# EAGLE board Layer 1 (EAGLE 9.6.2), part 1 of 2
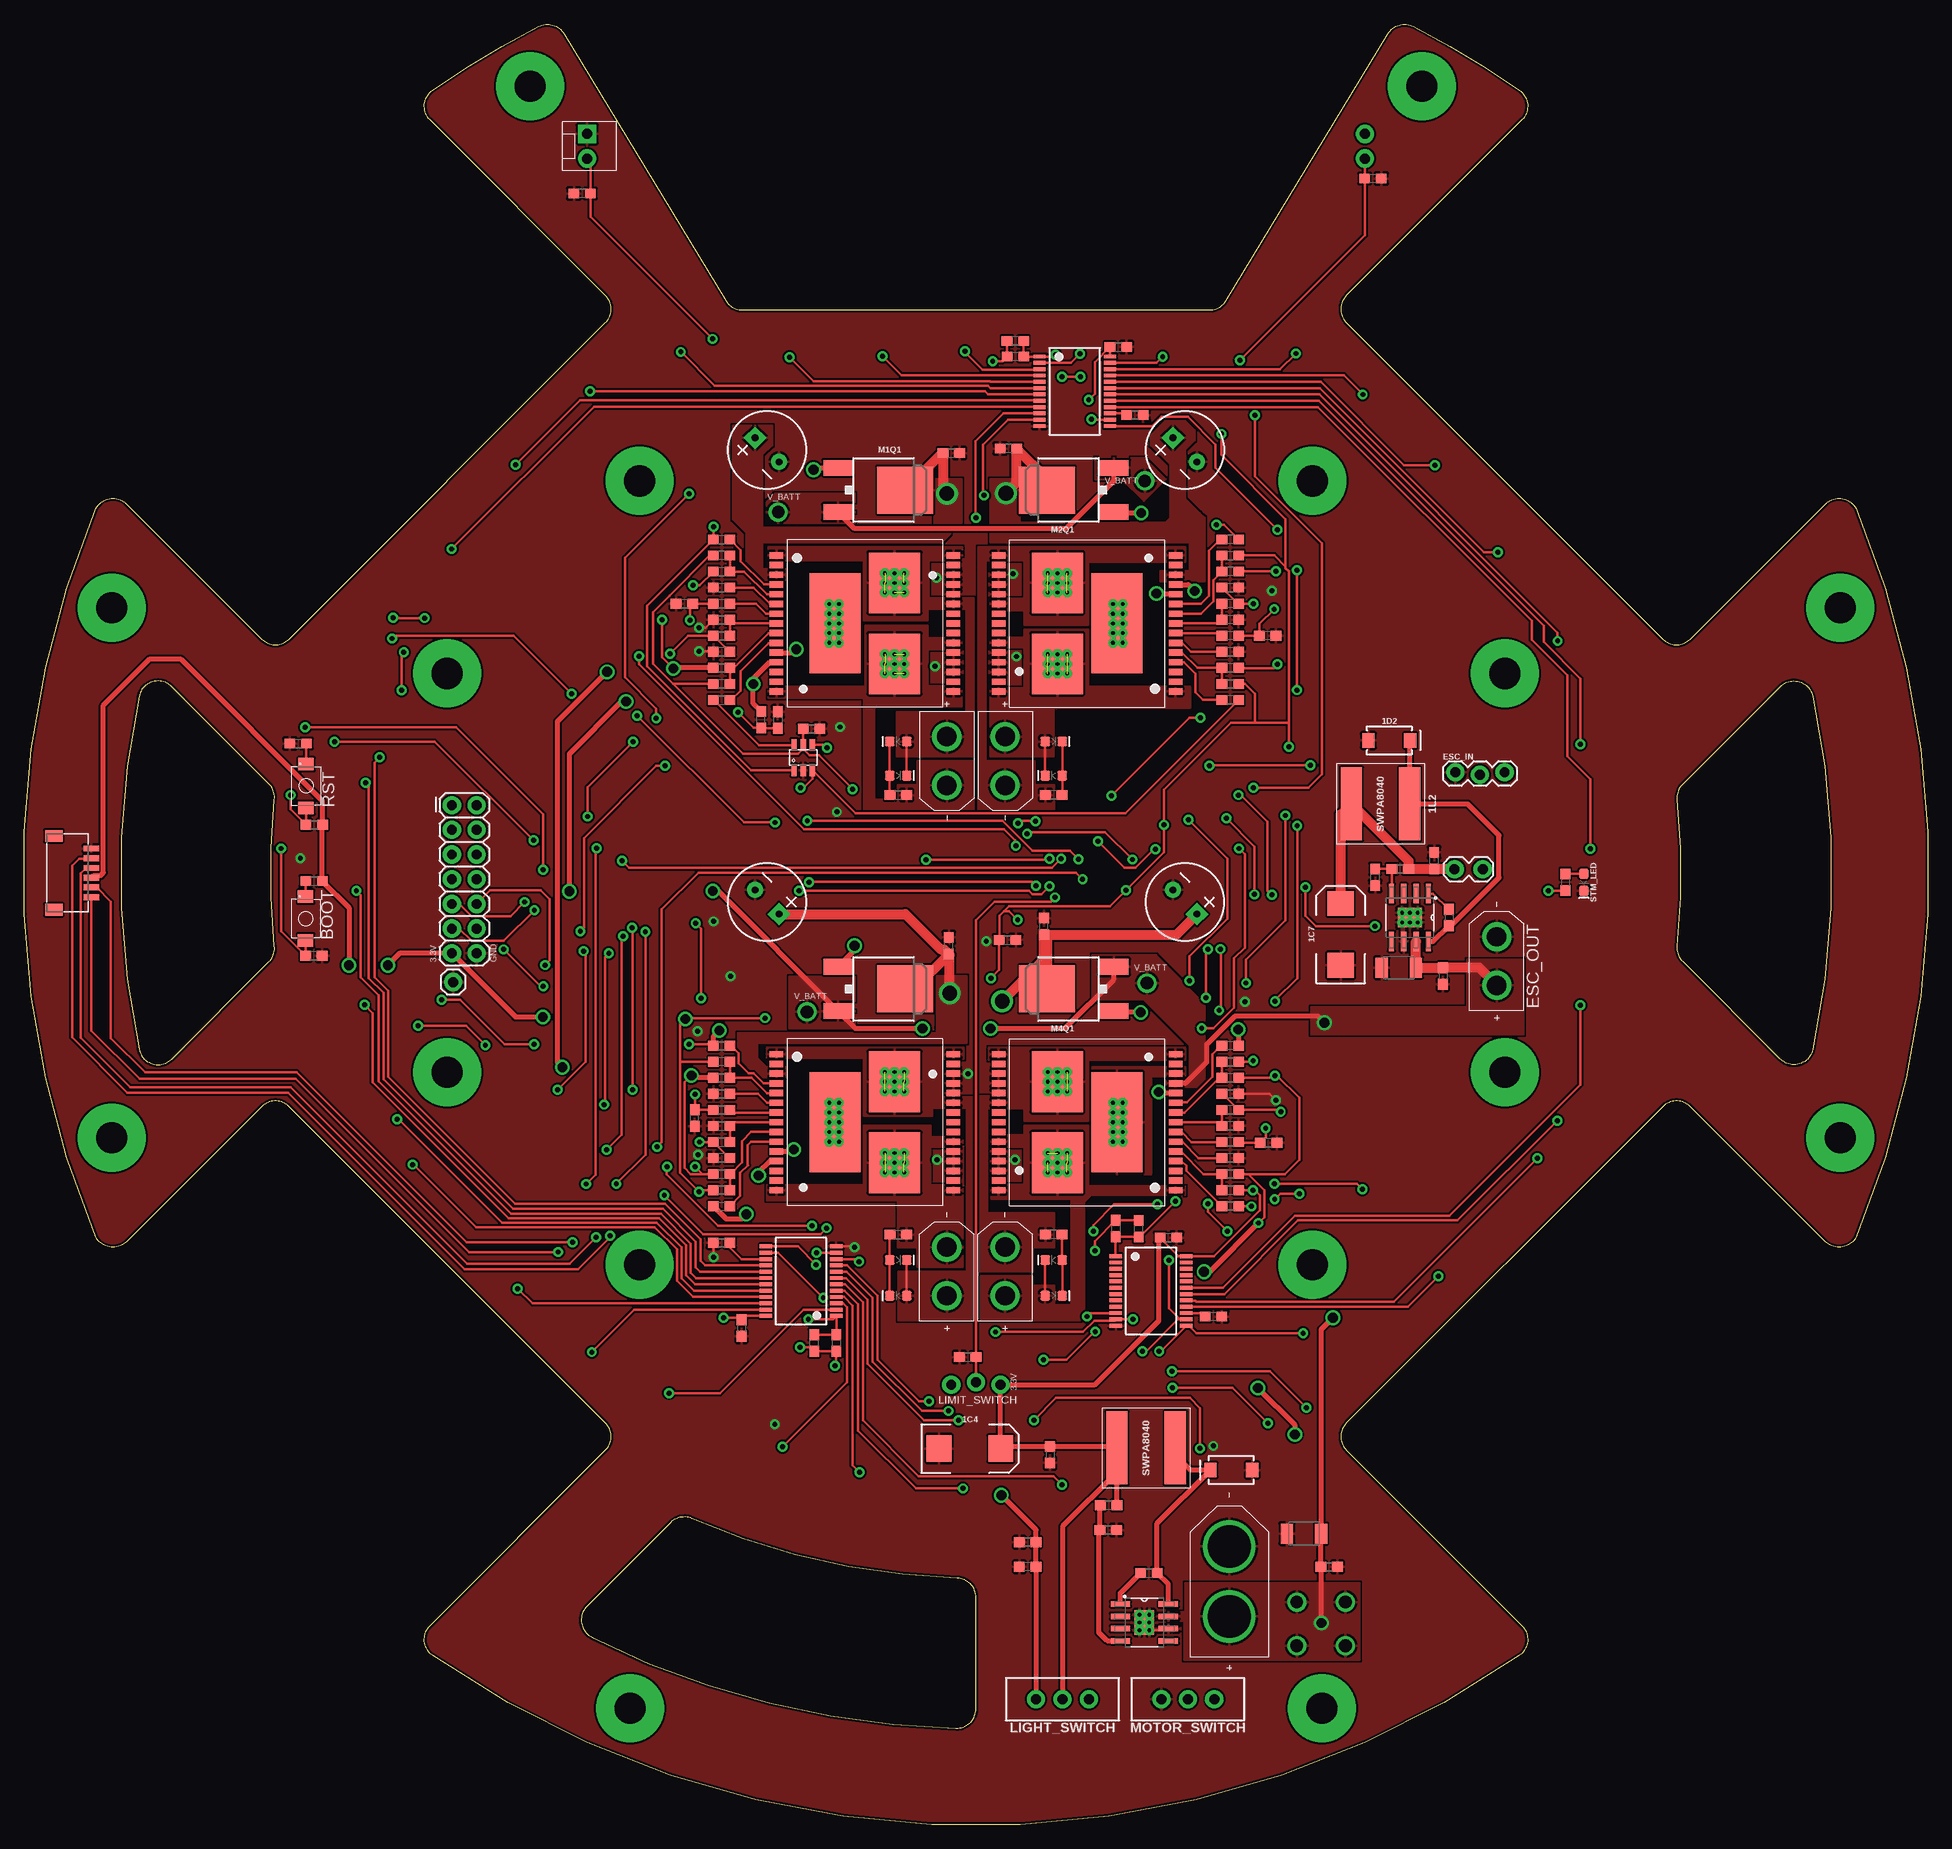
[diagram p5: board, top side]
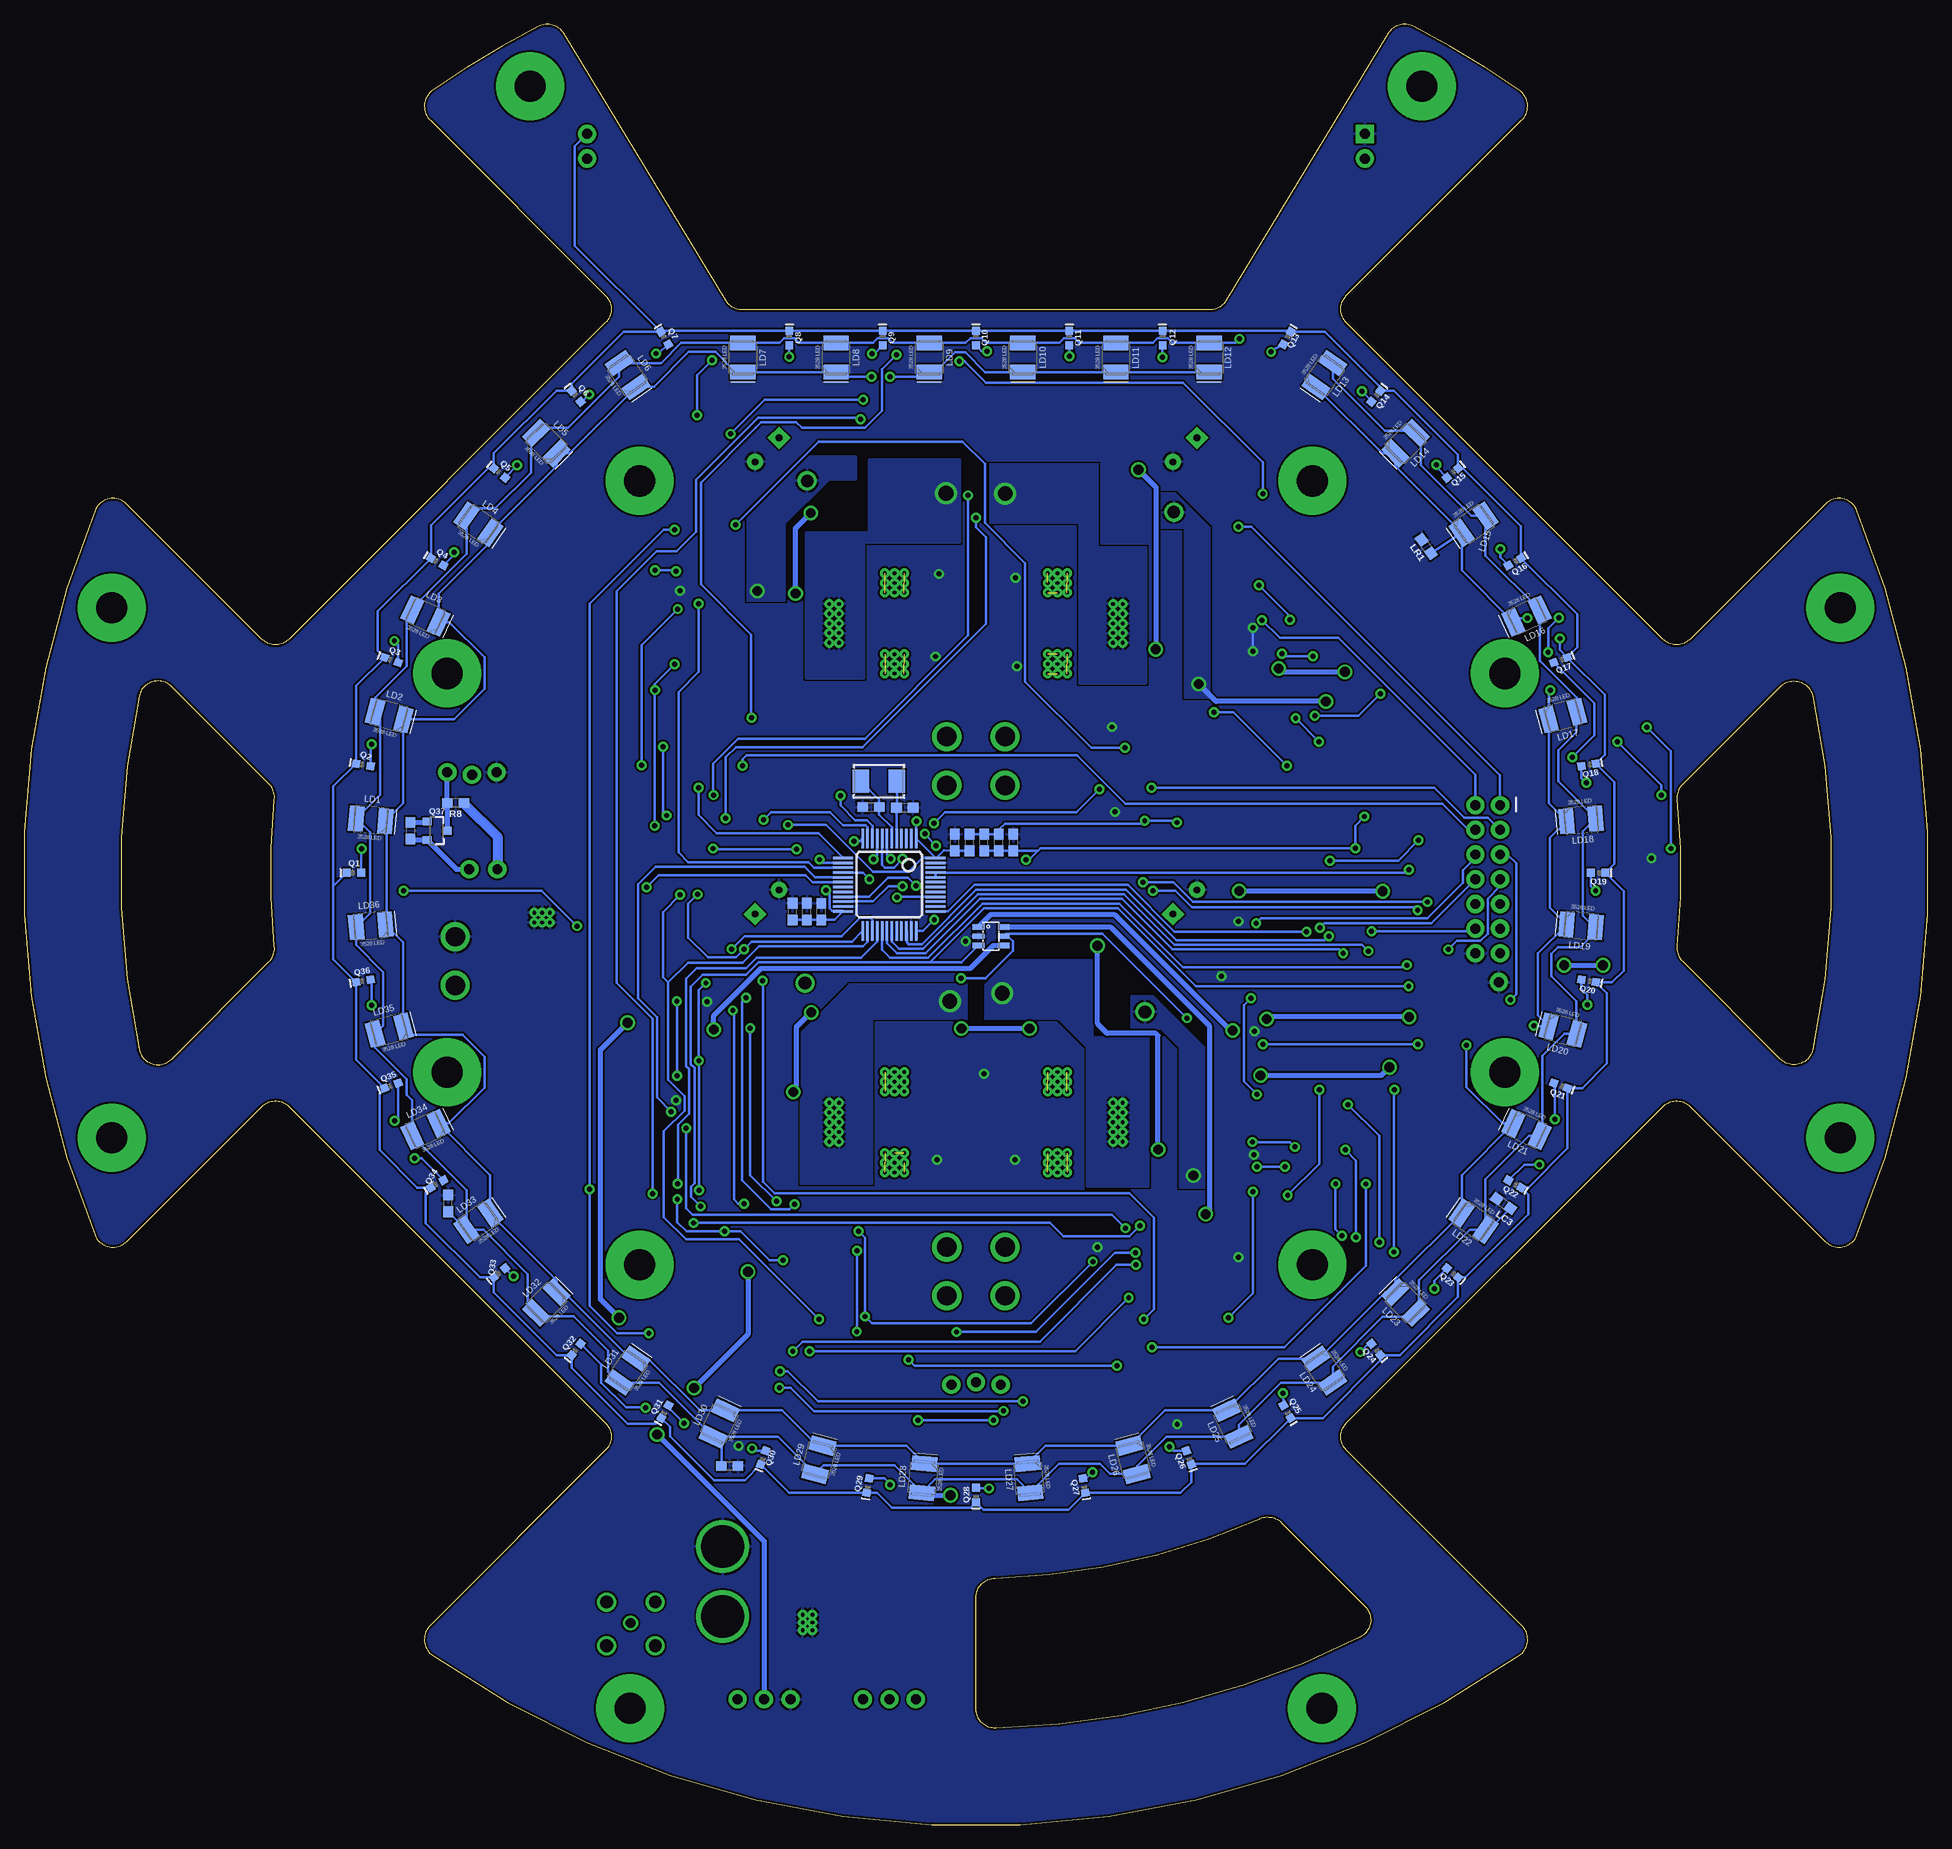
[diagram p6: board, bottom side, seen from below]

Size 195.82 x 185.17 mm. Coordinates in mm from the lower left corner, seen from the top.
Outline: 72.18,156.75 arc59 73.89,155.79 121.93,155.79 arc59 123.64,156.75 140.3,184.2 arc-86 142.92,184.94 arc-7 153.81,178.39 arc-100 154.08,175.33 136.04,157.29 arc90 136.04,154.46 168.57,121.93 arc90 171.4,121.93 185.28,135.82 arc-113 188.54,135.17 arc-45 188.54,60.62 arc-113 185.28,59.97 171.4,73.85 arc90 168.57,73.85 136.04,41.33 arc90 136.04,38.5 154.08,20.46 arc-100 153.81,17.4 arc-70 42.01,17.4 arc-100 41.74,20.46 59.78,38.5 arc90 59.78,41.33 27.25,73.85 arc90 24.42,73.85 10.54,59.97 arc-113 7.27,60.62 arc-45 7.27,135.17 arc-113 10.54,135.82 24.42,121.93 arc90 27.25,121.93 59.78,154.46 arc90 59.78,157.29 41.74,175.33 arc-100 42.01,178.39 arc-7 52.89,184.94 arc-86 55.52,184.2 72.18,156.75
Outline: 170.66,88.73 arc-51 170.09,90.35 arc12 170.09,105.44 arc-51 170.66,107.06 180.65,117.04 arc-123 184.02,116.04 arc-24 184.02,79.75 arc-123 180.65,78.75 170.66,88.73
Outline: 68.7,31.47 arc69 66.48,31.06 57.88,22.46 arc108 58.4,19.26 arc25 95.86,9.92 arc91 97.91,11.92 97.91,23.36 arc88 95.96,25.36 arc-22 68.7,31.47
Outline: 25.16,88.73 arc51 25.73,90.35 arc-12 25.73,105.44 arc51 25.16,107.06 15.17,117.04 arc123 11.8,116.04 arc24 11.8,79.75 arc123 15.17,78.75 25.16,88.73
Copper layers (1*16): Top 0.035mm / dielectric 1.5mm / Bottom 0.035mm
Design rules "Sparkfun": minimum track width 8mil, minimum drill 20mil, track to track 8mil, track to pad 8mil, pad to pad 8mil, via to via 8mil, smd to smd 8mil, copper to edge 10mil, drill to drill 8mil, minimum pad ring 12mil, minimum via ring 10mil, stop-mask expansion 4mil, vias tented up to drill 25mil, thermal gap 10mil

## Footprints (pad centres in the part's own frame; a part is rotated, then mirrored left to right if it is on the bottom)
C0603 = smd 1.1 x 1: 1 -0.85,0; 2 0.85,0
C1210 = smd 1.27 x 2.06: 1 -1.755,0; 2 1.755,0
EIA7343 = smd 2.55 x 2.7: A 3.17,0; C -3.17,0
SMA-DIODE = smd 1.27 x 1.47: A -2.15,0; C 2.15,0
SWPA8040 = smd 2.2 x 7.5: P1 -3,0; P2 3,0
R0603 = smd 1.1 x 1: 1 -0.85,0; 2 0.85,0
MOMENTARY_SWITCH_4X3 = smd 1.3 x 1.6: P$1 -2.25,0; P$2 2.25,0
LED-0603 = smd 1 x 1: A -0.877,0; C 0.877,0
1X03_LOCK = drill 1.016 pad 1.88: 1 0,0.127; 2 2.54,-0.127; 3 5.08,0.127
XT30PB-F = drill 2: + -2.5,0; - 2.5,0
0603 = smd 1.1 x 1: 1 -0.85,0; 2 0.85,0
1X01 = drill 1.016 pad 1.88: 1 0,0
1X02_LOCK = drill 1.016 pad 1.88: 1 -0.178,0; 2 2.718,0
1X03_LOCK_NO_SILK = drill 1.016 pad 1.88: 1 0,0.127; 2 2.54,-0.127; 3 5.08,0.127
3528 = smd 1.5 x 2.6: A -1.5,0; C 1.5,0
1X02_NO_SILK = drill 1.016 pad 1.88: 1 0,0; 2 2.54,0
MOLEX-1X2 = drill 1.016 pad 1.88 square: 1 0,0 | drill 1.016 pad 1.88: 2 2.54,0
SWITCH_SPDT_PTH_11.6X4.0MM_LOCK = drill 1.016 pad 1.88: 1 0,2.718; 2 0,0; 3 0,-2.718
3.5MM_CAP = drill 0.7 pad 1.651 square: 1 1.75,0 | drill 0.7 pad 1.651: 2 -1.75,0
DPAK = smd 1.6 x 3: 1 -2.28,-5.31; 3 2.28,-5.31 | smd 4.826 x 5.715: 4 0,1.588
POWERSO-30 = smd 0.65 x 1.4: P1 -7,-9.1; P2 -6,-9.1; P3 -5,-9.1; P4 -4,-9.1; P5 -3,-9.1; P6 -2,-9.1; P7 -1,-9.1; P8 0,-9.1; P9 1,-9.1; P10 2,-9.1; P11 3,-9.1; P12 4,-9.1; P13 5,-9.1; P14 6,-9.1; P15 7,-9.1; P16 7,9.1; P17 6,9.1; P18 5,9.1; P19 4,9.1; P20 3,9.1; P21 2,9.1; P22 1,9.1; P23 0,9.1; P24 -1,9.1; P25 -2,9.1; P26 -3,9.1; P27 -4,9.1; P28 -5,9.1; P29 -6,9.1; P30 -7,9.1 | drill 0.381: P$1 -4.165,3.05; P$2 -3.165,3.05; P$3 -5.165,3.05; P$4 -5.165,2.05; P$5 -4.165,2.05; P$6 -3.165,2.05; P$7 -5.165,4.05; P$8 -4.165,4.05; P$9 -3.165,4.05; P$10 4.165,3.05; P$11 5.165,3.05; P$12 3.165,3.05; P$13 3.165,2.05; P$14 4.165,2.05; P$15 5.165,2.05; P$16 3.165,4.05; P$17 4.165,4.05; P$18 5.165,4.05; P$19 0,-2.669; P$20 -1,-2.669; P$21 1,-2.669; P$22 -2,-2.669; P$23 2,-2.669; P$24 0,-3.669; P$25 1,-3.669; P$26 2,-3.669; P$27 -1,-3.669; P$28 -2,-3.669 | smd 10.3 x 5.25: SLUG1 0,-3.05 | smd 6.23 x 5.25: SLUG2 -4.165,3.05; SLUG3 4.165,3.05
SOT23-6 = smd 0.55 x 1.2: 1 -0.95,-1.3; 2 0,-1.3; 3 0.95,-1.3; 4 0.95,1.3; 5 0,1.3; 6 -0.95,1.3
SSOP24 = smd 0.4 x 1.25: 1 -3.575,-3.625; 2 -2.925,-3.625; 3 -2.275,-3.625; 4 -1.625,-3.625; 5 -0.975,-3.625; 6 -0.325,-3.625; 7 0.325,-3.625; 8 0.975,-3.625; 9 1.625,-3.625; 10 2.275,-3.625; 11 2.925,-3.625; 12 3.575,-3.625; 13 3.575,3.625; 14 2.925,3.625; 15 2.275,3.625; 16 1.625,3.625; 17 0.975,3.625; 18 0.325,3.625; 19 -0.325,3.625; 20 -0.975,3.625; 21 -1.625,3.625; 22 -2.275,3.625; 23 -2.925,3.625; 24 -3.575,3.625
ALS-PT19 = smd 0.8 x 0.8: C -0.75,0; E 0.75,0
SOT23-3 = smd 0.8 x 0.9: 1 -0.95,-1; 2 0.95,-1; 3 0,1.1
POWERPAD-SOIC-8 = smd 1.981 x 0.559: 1 -2.464,1.905; 2 -2.464,0.635; 3 -2.464,-0.635; 4 -2.464,-1.905; 5 2.464,-1.905; 6 2.464,-0.635; 7 2.464,0.635; 8 2.464,1.905 | smd 2.007 x 2.489: 9 0,0 | drill 0.381: P$1 -0.5,0.8; P$2 0.5,0.8; P$3 -0.5,0; P$4 0.5,0; P$5 -0.5,-0.8; P$6 0.5,-0.8
XT60PB-M = drill 4.4: + -3.6,0; - 3.6,0
LQFP48 = smd 0.254 x 2.032: 1 -2.75,-4.758; 2 -2.25,-4.758; 3 -1.75,-4.758; 4 -1.25,-4.758; 5 -0.75,-4.758; 6 -0.25,-4.758; 7 0.25,-4.758; 8 0.75,-4.758; 9 1.25,-4.758; 10 1.75,-4.758; 11 2.25,-4.758; 12 2.75,-4.758; 25 2.75,4.758; 26 2.25,4.758; 27 1.75,4.758; 28 1.25,4.758; 29 0.75,4.758; 30 0.25,4.758; 31 -0.25,4.758; 32 -0.75,4.758; 33 -1.25,4.758; 34 -1.75,4.758; 35 -2.25,4.758; 36 -2.75,4.758 | smd 2.032 x 0.254: 13 4.758,-2.75; 14 4.758,-2.25; 15 4.758,-1.75; 16 4.758,-1.25; 17 4.758,-0.75; 18 4.758,-0.25; 19 4.758,0.25; 20 4.758,0.75; 21 4.758,1.25; 22 4.758,1.75; 23 4.758,2.25; 24 4.758,2.75; 37 -4.758,2.75; 38 -4.758,2.25; 39 -4.758,1.75; 40 -4.758,1.25; 41 -4.758,0.75; 42 -4.758,0.25; 43 -4.758,-0.25; 44 -4.758,-0.75; 45 -4.758,-1.25; 46 -4.758,-1.75; 47 -4.758,-2.25; 48 -4.758,-2.75
2X7 = drill 1.016 pad 1.88: 1 0,0; 2 0,2.54; 3 2.54,0; 4 2.54,2.54; 5 5.08,0; 6 5.08,2.54; 7 7.62,0; 8 7.62,2.54; 9 10.16,0; 10 10.16,2.54; 11 12.7,0; 12 12.7,2.54; 13 15.24,0; 14 15.24,2.54
18AWG = drill 1.3: P$1 0,0
SM06B-SRSS-TB = smd 0.6 x 1.55: 1 2.5,0; 2 1.5,0; 3 0.5,0; 4 -0.5,0; 5 -1.5,0; 6 -2.5,0 | smd 1.2 x 1.8: M1 3.8,3.875; M2 -3.8,3.875
CRYSTAL-SMD-5X3.2-2PAD = smd 1.7 x 2.4: P$1 1.85,0; P$2 -1.85,0

## Placement (x,y rotation side)
1C1  4.7uF  [C0603]  134.24,26.51 0 top
1C2  22uF  [C1210]  131.65,29.94 180 top
1C3  10nF  [C0603]  115.69,25.88 0 top
1C4  220uF  [EIA7343]  97.28,38.68 0 top
1C5  0.1uF  [C0603]  105.52,38.04 270 top
1C6  4.7uF  [C0603]  145.93,87.28 270 top
1C7  220uF  [EIA7343]  135.43,91.56 90 top
1C8  10nF  [C0603]  146.55,93.3 270 top
1C9  0.1uF  [C0603]  145.05,99.14 90 top
1C10  22uF  [C1210]  141.41,88.15 180 top
1D1  SS54  [SMA-DIODE]  124.17,36.47 180 top
1D2  SS54  [SMA-DIODE]  140.43,111.51 0 top
1L1  10uH  [SWPA8040]  115.41,38.74 180 top
1L2  10uH  [SWPA8040]  139.53,104.99 180 top
1R1  10k  [R0603]  111.55,32.86 0 top
1R2  5.9k  [R0603]  111.51,30.29 180 top
1R3  10k  [R0603]  141.55,98.3 0 top
1R4  3.24k  [R0603]  138.98,97.43 90 top
2C1  0.1uF  [C0603]  112.55,151.98 0 top
2C2  0.1uF  [C0603]  73.79,51.07 270 top
2C3  0.1uF  [C0603]  117.7,60.38 0 top
2C4  1uF  [C0603]  101.96,152.6 180 top
2C5  1uF  [C0603]  83.54,49.53 270 top
2C6  1uF  [C0603]  114.65,61.3 90 top
2R1  1k  [R0603]  114.26,144.97 180 top
2R2  1k  [R0603]  71.73,59.84 0 top
2R3  1k  [R0603]  122.35,52.25 180 top
2R4  3k  [R0603]  101.96,151.01 0 top
2R5  3k  [R0603]  81.27,49.54 90 top
2R6  3k  [R0603]  112.28,61.31 270 top
3C1  0.1uF  [C0603]  80.98,112.72 0 top
3C2  0.1uF  [C0603]  101.15,90.99 0 top
BOOT  MOMENTARY_SWITCH_4X3  [MOMENTARY_SWITCH_4X3]  28.93,93.19 270 top
C1  1uF  [C0603]  113.82,93.9 90 bottom
C2  1uF  [C0603]  115.3,93.91 90 bottom
C3  1uF  [C0603]  116.78,93.91 90 bottom
C4  10nF  [C0603]  95.57,101.02 90 bottom
C5  1uF  [C0603]  97.07,101.02 90 bottom
C6  22pF  [C0603]  105.24,104.58 180 bottom
C7  22pF  [C0603]  108.71,104.66 0 bottom
C8  1uF  [C0603]  100.09,101.02 90 bottom
D1  STM_LED  [LED-0603]  160.44,96.92 270 top
ESC_IN  [1X03_LOCK]  147.22,108.1 0 top
ESC_OUT  XT30PB-F  [XT30PB-F]  151.48,88.82 90 top
FB1  30Ω/1.8A  [0603]  98.57,101.02 90 bottom
FB2  30Ω/1.8A  [0603]  94.07,101.02 270 bottom
GND  [1X01]  44.11,86.66 0 top
J1  [1X02_LOCK]  149.86,98.26 180 top
J2  [1X03_LOCK_NO_SILK]  100.44,45.37 180 top
LC1  1uF  [C0603]  57.39,167.76 180 top
LC2  1uF  [C0603]  103.23,29.05 180 top
LC3  1uF  [C0603]  43.63,63.87 145 bottom
LC4  1uF  [C0603]  103.22,26.52 180 top
LC5  1uF  [C0603]  123.25,36.9 0 bottom
LC6  1uF  [C0603]  152.21,63.89 90 bottom
LD1  3528LED  [3528]  160.17,103.34 355 bottom
LD2  3528LED  [3528]  158.28,114.07 345 bottom
LD3  3528LED  [3528]  154.55,124.31 335 bottom
LD4  3528LED  [3528]  149.11,133.74 325 bottom
LD5  3528LED  [3528]  142.1,142.09 315 bottom
LD6  3528LED  [3528]  133.76,149.09 305 bottom
LD7  3528LED  [3528]  121.91,150.89 270 bottom
LD8  3528LED  [3528]  112.31,150.89 270 bottom
LD9  3528LED  [3528]  102.71,150.89 270 bottom
LD10  3528LED  [3528]  93.11,150.89 270 bottom
LD11  3528LED  [3528]  83.51,150.89 270 bottom
LD12  3528LED  [3528]  73.91,150.89 270 bottom
LD13  3528LED  [3528]  62.06,149.09 235 bottom
LD14  3528LED  [3528]  53.71,142.09 225 bottom
LD15  3528LED  [3528]  46.71,133.74 215 bottom
LD16  3528LED  [3528]  41.26,124.31 205 bottom
LD17  3528LED  [3528]  37.54,114.07 195 bottom
LD18  3528LED  [3528]  35.65,103.34 185 bottom
LD19  3528LED  [3528]  35.65,92.45 175 bottom
LD20  3528LED  [3528]  37.54,81.72 165 bottom
LD21  3528LED  [3528]  41.26,71.48 155 bottom
LD22  3528LED  [3528]  46.71,62.05 145 bottom
LD23  3528LED  [3528]  53.71,53.7 135 bottom
LD24  3528LED  [3528]  62.06,46.7 125 bottom
LD25  3528LED  [3528]  71.49,41.25 115 bottom
LD26  3528LED  [3528]  81.73,37.52 105 bottom
LD27  3528LED  [3528]  92.46,35.63 95 bottom
LD28  3528LED  [3528]  103.36,35.63 85 bottom
LD29  3528LED  [3528]  114.08,37.52 75 bottom
LD30  3528LED  [3528]  124.32,41.25 65 bottom
LD31  3528LED  [3528]  133.76,46.7 55 bottom
LD32  3528LED  [3528]  142.1,53.7 45 bottom
LD33  3528LED  [3528]  149.11,62.05 35 bottom
LD34  3528LED  [3528]  154.55,71.48 25 bottom
LD35  3528LED  [3528]  158.28,81.72 15 bottom
LD36  3528LED  [3528]  160.17,92.45 5 bottom
LDR  [1X02_NO_SILK]  137.91,173.89 270 top
LED  [MOLEX-1X2]  57.91,173.89 270 top
LG_R2  2k  [R0603]  138.75,169.3 180 top
LIGHT_SWITCH  [SWITCH_SPDT_PTH_11.6X4.0MM_LOCK]  106.81,12.89 90 top
LR1  47  [R0603]  51.58,131.45 125 bottom
M1C1  33nF  [C0603]  71.75,120.63 180 top
M1C2  680uF  [3.5MM_CAP]  76.41,141.39 135 top
M1C3  1.0uF  [C0603]  95.37,141.07 0 top
M1D1  RED  [LED-0603]  89.91,107.89 0 top
M1D2  BLUE  [LED-0603]  89.91,111.39 180 top
M1J1  XT30PB-F  [XT30PB-F]  94.91,109.39 270 top
M1Q1  AOD482  [DPAK]  89.02,137.26 270 top
M1R1  1k  [R0603]  71.75,128.88 0 top
M1R2  1k  [R0603]  71.75,118.98 0 top
M1R3  3.3k  [R0603]  71.75,117.33 180 top
M1R4  3.3k  [R0603]  71.75,130.53 180 top
M1R5  1k  [R0603]  71.75,132.18 0 top
M1R6  1k  [R0603]  71.75,115.67 0 top
M1R7  1k  [R0603]  71.75,125.58 0 top
M1R8  10k  [R0603]  71.75,122.28 0 top
M1R9  10k  [R0603]  71.75,127.23 0 top
M1R10  1k  [R0603]  71.75,123.93 0 top
M1R11  10k  [R0603]  67.91,125.58 0 top
M1R12  4.7k  [R0603]  89.91,105.89 0 top
M2C1  33nF  [C0603]  124.07,127.23 0 top
M2C2  680uF  [3.5MM_CAP]  119.41,141.39 135 top
M2C3  1.0uF  [C0603]  101.25,141.53 180 top
M2D1  RED  [LED-0603]  105.91,107.89 180 top
M2D2  BLUE  [LED-0603]  105.91,111.39 0 top
M2J1  XT30PB-F  [XT30PB-F]  100.91,109.39 270 top
M2Q1  AOD482  [DPAK]  106.8,137.26 90 top
M2R1  1k  [R0603]  124.07,118.98 180 top
M2R2  1k  [R0603]  124.07,128.88 180 top
M2R3  3.3k  [R0603]  124.07,130.53 0 top
M2R4  3.3k  [R0603]  124.07,117.33 0 top
M2R5  1k  [R0603]  124.07,115.67 180 top
M2R6  1k  [R0603]  124.07,132.18 180 top
M2R7  1k  [R0603]  124.07,122.28 180 top
M2R8  10k  [R0603]  124.07,125.58 180 top
M2R9  10k  [R0603]  124.07,120.63 180 top
M2R10  1k  [R0603]  124.07,123.93 180 top
M2R11  10k  [R0603]  127.91,122.28 180 top
M2R12  4.7k  [R0603]  105.91,105.89 180 top
M3C1  33nF  [C0603]  71.75,68.56 180 top
M3C2  680uF  [3.5MM_CAP]  76.41,94.89 315 top
M3C3  1.0uF  [C0603]  95.11,90.39 90 top
M3D1  RED  [LED-0603]  89.91,58.07 0 top
M3D2  BLUE  [LED-0603]  89.91,54.4 180 top
M3J1  XT30PB-F  [XT30PB-F]  94.91,56.89 90 top
M3Q1  AOD482  [DPAK]  89.02,85.96 270 top
M3R1  1k  [R0603]  71.75,76.81 0 top
M3R2  1k  [R0603]  71.75,66.91 0 top
M3R3  3.3k  [R0603]  71.75,65.26 180 top
M3R4  3.3k  [R0603]  71.75,78.46 180 top
M3R5  1k  [R0603]  71.75,80.11 0 top
M3R6  1k  [R0603]  71.75,63.6 0 top
M3R7  1k  [R0603]  71.75,73.51 0 top
M3R8  10k  [R0603]  71.75,70.21 0 top
M3R9  10k  [R0603]  71.75,75.16 0 top
M3R10  1k  [R0603]  71.75,71.86 0 top
M3R11  10k  [R0603]  68.97,72.68 90 top
M3R12  4.7k  [R0603]  89.91,60.69 0 top
M4C1  33nF  [C0603]  124.07,75.16 0 top
M4C2  680uF  [3.5MM_CAP]  119.41,94.89 315 top
M4C3  1.0uF  [C0603]  104.91,92.39 90 top
M4D1  RED  [LED-0603]  105.91,58.07 180 top
M4D2  BLUE  [LED-0603]  105.91,54.4 0 top
M4J1  XT30PB-F  [XT30PB-F]  100.91,56.89 90 top
M4Q1  AOD482  [DPAK]  106.8,85.96 90 top
M4R1  1k  [R0603]  124.07,66.91 180 top
M4R2  1k  [R0603]  124.07,76.81 180 top
M4R3  3.3k  [R0603]  124.07,78.46 0 top
M4R4  3.3k  [R0603]  124.07,65.26 0 top
M4R5  1k  [R0603]  124.07,63.6 180 top
M4R6  1k  [R0603]  124.07,80.11 180 top
M4R7  1k  [R0603]  124.07,70.21 180 top
M4R8  10k  [R0603]  124.07,73.51 180 top
M4R9  10k  [R0603]  124.07,68.56 180 top
M4R10  1k  [R0603]  124.07,71.86 180 top
M4R11  10k  [R0603]  128.01,70.12 180 top
M4R12  4.7k  [R0603]  105.91,60.69 180 top
M_BL  VNH5019  [POWERSO-30]  86.48,72.24 270 top
M_BR  VNH5019  [POWERSO-30]  109.34,72.24 90 top
M_FL  VNH5019  [POWERSO-30]  86.48,123.55 270 top
M_FR  VNH5019  [POWERSO-30]  109.34,123.55 90 top
MOTOR_SWITCH  [SWITCH_SPDT_PTH_11.6X4.0MM_LOCK]  119.71,12.89 90 top
MU1  [SOT23-6]  80.13,109.75 0 top
MU2  [SOT23-6]  96.35,91.37 270 bottom
MUX_L1  [SSOP24]  108.07,147.42 270 top
MUX_L2  [SSOP24]  79.91,55.89 90 top
MUX_L3  [SSOP24]  115.91,54.89 270 top
Q1  [ALS-PT19]  161.91,97.89 0 bottom
Q2  [ALS-PT19]  160.94,109.01 350 bottom
Q3  [ALS-PT19]  158.05,119.78 340 bottom
Q4  [ALS-PT19]  153.33,129.89 330 bottom
Q5  [ALS-PT19]  146.94,139.03 320 bottom
Q6  [ALS-PT19]  139.05,146.92 310 bottom
Q7  [ALS-PT19]  129.95,152.89 300 bottom
Q8  [ALS-PT19]  117.11,152.89 270 bottom
Q9  [ALS-PT19]  107.51,152.89 270 bottom
Q10  [ALS-PT19]  97.91,152.89 270 bottom
Q11  [ALS-PT19]  88.31,152.89 270 bottom
Q12  [ALS-PT19]  78.71,152.89 270 bottom
Q13  [ALS-PT19]  65.91,152.89 240 bottom
Q14  [ALS-PT19]  56.77,146.92 230 bottom
Q15  [ALS-PT19]  48.88,139.03 220 bottom
Q16  [ALS-PT19]  42.48,129.89 210 bottom
Q17  [ALS-PT19]  37.77,119.78 200 bottom
Q18  [ALS-PT19]  34.88,109.01 190 bottom
Q19  [ALS-PT19]  33.91,97.89 180 bottom
Q20  [ALS-PT19]  34.88,86.78 170 bottom
Q21  [ALS-PT19]  37.77,76 160 bottom
Q22  [ALS-PT19]  42.48,65.89 150 bottom
Q23  [ALS-PT19]  48.88,56.76 140 bottom
Q24  [ALS-PT19]  56.77,48.87 130 bottom
Q25  [ALS-PT19]  65.91,42.47 120 bottom
Q26  [ALS-PT19]  76.02,37.75 110 bottom
Q27  [ALS-PT19]  86.79,34.87 100 bottom
Q28  [ALS-PT19]  97.91,33.89 90 bottom
Q29  [ALS-PT19]  109.02,34.87 80 bottom
Q30  [ALS-PT19]  119.8,37.75 70 bottom
Q31  [ALS-PT19]  129.91,42.47 60 bottom
Q32  [ALS-PT19]  139.05,48.87 50 bottom
Q33  [ALS-PT19]  146.94,56.76 40 bottom
Q34  [ALS-PT19]  153.33,65.89 30 bottom
Q35  [ALS-PT19]  158.05,76 20 bottom
Q36  [ALS-PT19]  160.94,86.78 10 bottom
Q37  AO3402  [SOT23-3]  153.38,102.22 270 bottom
R1  10k  [R0603]  29.84,102.83 0 top
R2  1k  [R0603]  28.17,111.2 0 top
R3  1k  [R0603]  29.81,97.05 0 top
R4  10k  [R0603]  29.79,89.36 180 top
R5  470  [R0603]  158.53,96.92 270 top
R6  2M  [R0603]  75.81,113.64 90 top
R7  500k  [R0603]  77.51,113.61 270 top
R8  4.7k  [R0603]  151.45,105.07 180 bottom
R9  4.7k  [R0603]  156.11,102.22 270 bottom
R10  10k  [R0603]  97.07,48.09 0 top
RST  MOMENTARY_SWITCH_4X3  [MOMENTARY_SWITCH_4X3]  28.98,106.83 270 top
U1  [POWERPAD-SOIC-8]  115.23,20.79 0 top
U2  [POWERPAD-SOIC-8]  142.55,93.3 270 top
U$1  XT60XT60PB-M  [XT60PB-M]  123.97,25.01 90 top
U$2  STM32F103CBT6  [LQFP48]  106.82,96.68 180 bottom
U$15  CONN_07X2  [2X7]  43.99,104.85 270 top
V_BATT_M1A  18AWG  [18AWG]  77.56,135 0 top
V_BATT_M1B  18AWG  [18AWG]  135.91,22.89 0 top
V_BATT_M2A  18AWG  [18AWG]  115.28,138.2 0 top
V_BATT_M2B  18AWG  [18AWG]  135.91,18.39 0 top
V_BATT_M3A  18AWG  [18AWG]  80.52,83.59 0 top
V_BATT_M3B  18AWG  [18AWG]  130.91,22.89 0 top
V_BATT_M4A  18AWG  [18AWG]  115.5,86.56 0 top
V_BATT_M4B  18AWG  [18AWG]  130.91,18.39 0 top
X2  SM06B-SRSS-TB  [SM06B-SRSS-TB]  6.91,97.89 90 top
Y1  8MHz  [CRYSTAL-SMD-5X3.2-2PAD]  107.9,107.31 180 bottom